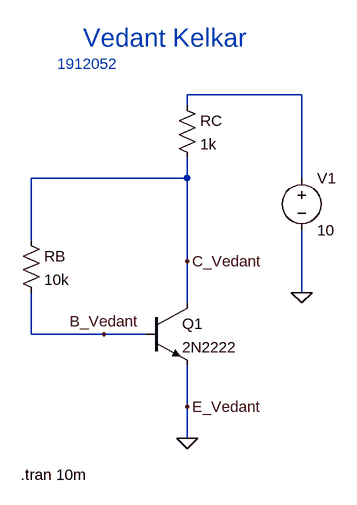
[diagram p0: schematic Draft35.asc]
Draft35.asc, the LTspice schematic file:
Version 4
SHEET 1 880 680
WIRE 368 -80 192 -80
WIRE 192 -64 192 -80
WIRE 192 48 192 16
WIRE 192 48 -48 48
WIRE 368 48 368 -80
WIRE -48 144 -48 48
WIRE 192 176 192 48
WIRE 368 224 368 128
WIRE 192 240 192 176
WIRE -48 288 -48 224
WIRE 64 288 -48 288
WIRE 128 288 64 288
WIRE 192 400 192 336
WIRE 192 448 192 400
FLAG 192 400 E_Vedant
FLAG 192 176 C_Vedant
FLAG 64 288 B_Vedant
FLAG 368 224 0
FLAG 192 448 0
SYMBOL res -64 128 R0
SYMATTR InstName RB
SYMATTR Value 10k
SYMBOL res 176 -80 R0
SYMATTR InstName RC
SYMATTR Value 1k
SYMBOL npn 128 240 R0
SYMATTR InstName Q1
SYMATTR Value 2N2222
SYMBOL voltage 368 32 R0
WINDOW 123 0 0 Left 0
WINDOW 39 0 0 Left 0
SYMATTR InstName V1
SYMATTR Value 10
TEXT 32 -168 Left 4 ;Vedant Kelkar
TEXT -8 -128 Left 2 ;1912052
TEXT -64 504 Left 2 !.tran 10m

The netlist it stands for:
* Draft35.asc
RB C_Vedant B_Vedant 10k
RC N001 C_Vedant 1k
Q1 C_Vedant B_Vedant 0 0 2N2222
V1 N001 0 10
.model NPN NPN
.model PNP PNP
.lib standard.bjt
* Vedant Kelkar
* 1912052
.tran 10m
.backanno
.end